# Altium schematic sheet STM32F103C8T6.SchDoc
size A4
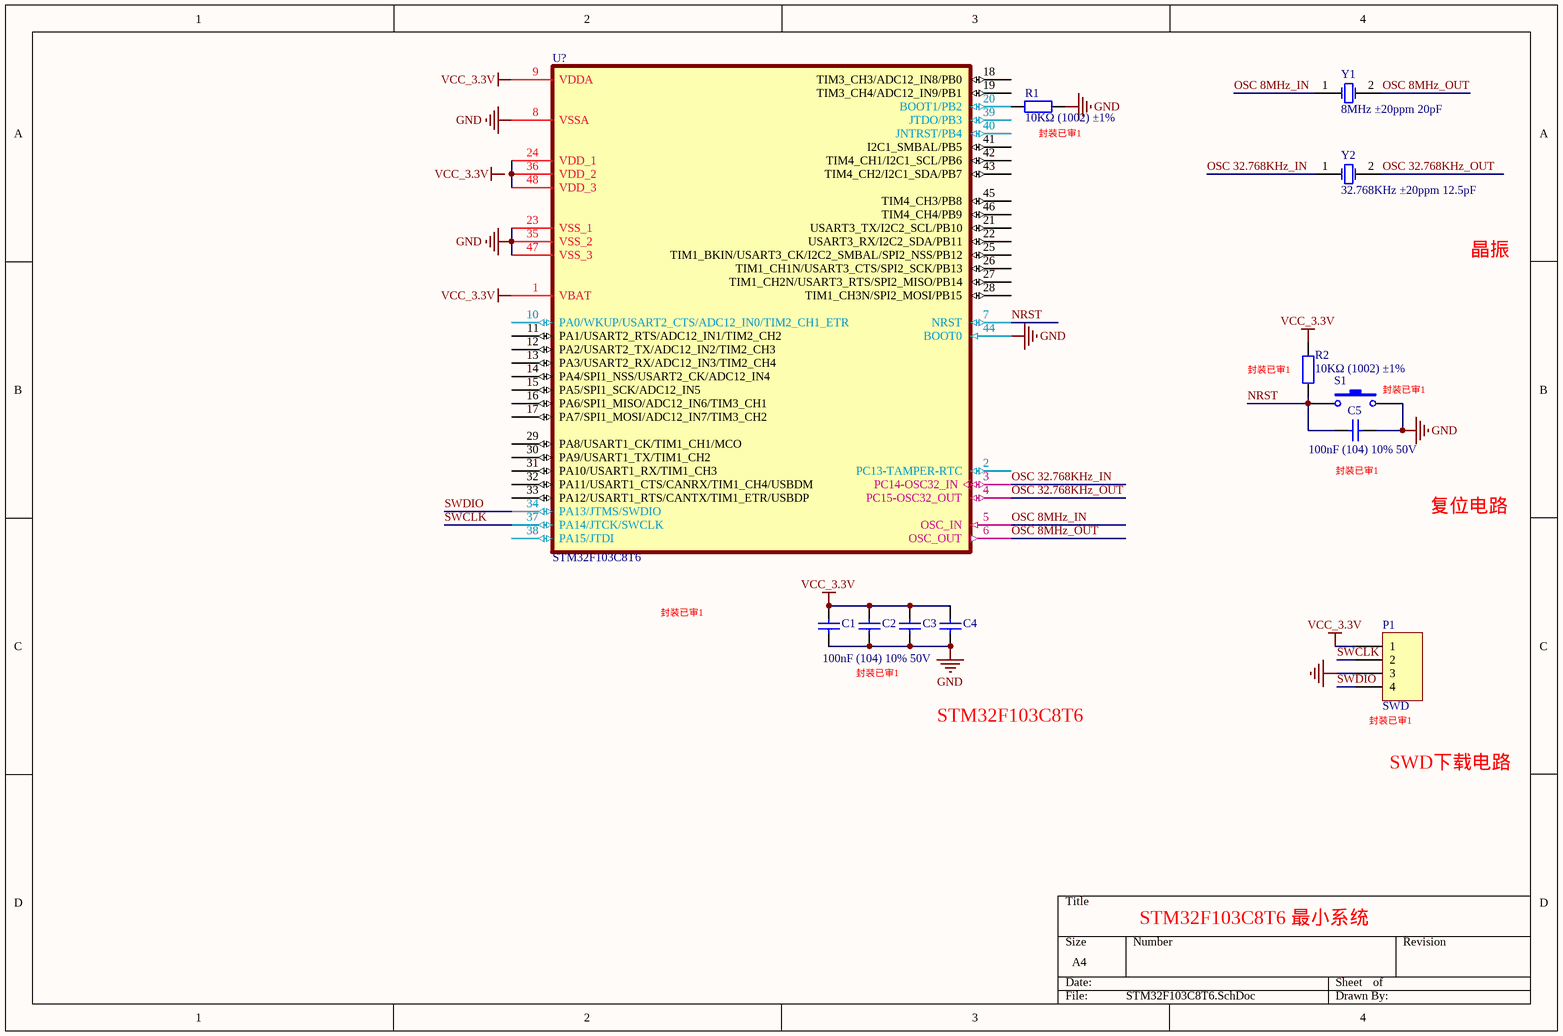
[diagram p0: STM32F103C8T6.SchDoc]

## Parts
C1  100nF (104) 10% 50V  [CAPC_0603_2]
C2  100nF (104) 10% 50V  [CAPC_0603_2]  (value not drawn)
C3  100nF (104) 10% 50V  [CAPC_0603_2]  (value not drawn)
C4  100nF (104) 10% 50V  [CAPC_0603_2]  (value not drawn)
C5  100nF (104) 10% 50V  [CAPC_0603_2]
P1  Header 2.54X4  [Header 2.54X4]  (value not drawn)
R1  10KΩ (1002) ±1%  [RESC_0603_2]
R2  10KΩ (1002) ±1%  [RESC_0603_2]
S1  SW-PB  [Header 2.54X2]  (value not drawn)
U?  STM32F103C8T6  [LQFP_48_7X7]
Y1  8MHz ±20ppm 20pF  [SMD-5032_2P]
Y2  32.768KHz ±20ppm 12.5pF  [SMD-3215_2P FC - 135]

## Nets
GND: C1.1 C2.1 C3.1 C4.1 C5.1 P1.3 R1.2 S1.2 U?.8(VSSA) U?.23(VSS_1) U?.35(VSS_2) U?.44(BOOT0) U?.47(VSS_3)
VCC_3.3V: C1.2 C2.2 C3.2 C4.2 P1.1 R2.2 U?.1(VBAT) U?.9(VDDA)
NRST: C5.2 R2.1 S1.1 U?.7(NRST)
OSC 8MHz_IN: U?.5(OSC_IN) Y1.1(OSC1)
OSC 8MHz_OUT: U?.6(OSC_OUT) Y1.2(OSC2)
OSC 32.768KHz_IN: U?.3(PC14-OSC32_IN) Y2.1(OSC1)
OSC 32.768KHz_OUT: U?.4(PC15-OSC32_OUT) Y2.2(OSC2)
SWCLK: P1.2 U?.37(PA14/JTCK/SWCLK)
SWDIO: P1.4 U?.34(PA13/JTMS/SWDIO)
NetR1_1: R1.1 U?.20(BOOT1/PB2)
NetU?_24: U?.24(VDD_1) U?.36(VDD_2) U?.48(VDD_3)

Not connected (* = marked no-connect by the designer): U? 2(PC13-TAMPER-RTC) 10(PA0/WKUP/USART2_CTS/ADC12_IN0/TIM2_CH1_ETR) 11(PA1/USART2_RTS/ADC12_IN1/TIM2_CH2) 12(PA2/USART2_TX/ADC12_IN2/TIM2_CH3) 13(PA3/USART2_RX/ADC12_IN3/TIM2_CH4) 14(PA4/SPI1_NSS/USART2_CK/ADC12_IN4) 15(PA5/SPI1_SCK/ADC12_IN5) 16(PA6/SPI1_MISO/ADC12_IN6/TIM3_CH1) 17(PA7/SPI1_MOSI/ADC12_IN7/TIM3_CH2) 18(TIM3_CH3/ADC12_IN8/PB0) 19(TIM3_CH4/ADC12_IN9/PB1) 21(USART3_TX/I2C2_SCL/PB10) 22(USART3_RX/I2C2_SDA/PB11) 25(TIM1_BKIN/USART3_CK/I2C2_SMBAL/SPI2_NSS/PB12) 26(TIM1_CH1N/USART3_CTS/SPI2_SCK/PB13) 27(TIM1_CH2N/USART3_RTS/SPI2_MISO/PB14) 28(TIM1_CH3N/SPI2_MOSI/PB15) 29(PA8/USART1_CK/TIM1_CH1/MCO) 30(PA9/USART1_TX/TIM1_CH2) 31(PA10/USART1_RX/TIM1_CH3) 32(PA11/USART1_CTS/CANRX/TIM1_CH4/USBDM) 33(PA12/USART1_RTS/CANTX/TIM1_ETR/USBDP) 38(PA15/JTDI) 39(JTDO/PB3) 40(JNTRST/PB4) 41(I2C1_SMBAL/PB5) 42(TIM4_CH1/I2C1_SCL/PB6) 43(TIM4_CH2/I2C1_SDA/PB7) 45(TIM4_CH3/PB8) 46(TIM4_CH4/PB9)

## Notes on the sheet
- (near R1) 封装已审1
- 晶振
- (near R2) 封装已审1
- (near S1) 封装已审1
- (near C5) 封装已审1
- 复位电路
- 封装已审1
- STM32F103C8T6
- (near P1) 封装已审1
- SWD下载电路
- STM32F103C8T6 最小系统
- Labels drawn without touching a wire or pin: VCC_3.3V

## Library data of the parts
C1-C5 = 0603 100nF (104) 10% 50V: 贴片电容; ComponentLink1Description: 供应商链接; ComponentLink1URL: http://www.szlcsc.com/product/details_15331.html; Package: 0603; Supplier: LC; SuppliersPartNumber: C14663
P1 = Header 4: Header, 4-Pin; LatestRevisionDate: 17-Jul-2002; LatestRevisionNote: Re-released for DXP Platform.; Publisher: Altium Limited; SWD: SWD
R1 R2 = 0603 10KΩ (1002) 1%: 贴片电阻; ComponentLink1Description: 供应商链接; ComponentLink1URL: http://www.szlcsc.com/product/details_26547.html; Package: 0603; Supplier: LC; SuppliersPartNumber: C25804
S1 = SW-PB_1: 微动开关; Published: 24-Mar-1999; LatestRevisionDate: 17-Jul-2002; LatestRevisionNote: Re-released for DXP Platform.; PackageReference: SPST-2; Publisher: Altium Limited
U? = STM32F103C8T6: ARM; ComponentLink1Description: 供应商链接; ComponentLink1URL: http://www.szlcsc.com/product/details_9243.html; Package: LQFP-48_7x7x05P; Supplier: LC; SuppliersPartNumber: C8734
Y1 = SMD-5032_2P 8MHz 20ppm 20pF: 贴片晶振; ComponentLink1Description: 供应商链接; ComponentLink1URL: http://www.szlcsc.com/product/details_117214.html; Package: SMD-5032_2P; Supplier: LC; SuppliersPartNumber: C115962
Y2 = SMD-3215_2P 32.768KHz 20ppm 12.5pF: 贴片晶振; ComponentLink1Description: 供应商链接; ComponentLink1URL: http://www.szlcsc.com/product/details_33310.html; Package: SMD-3215_2P; Supplier: LC; SuppliersPartNumber: C32346